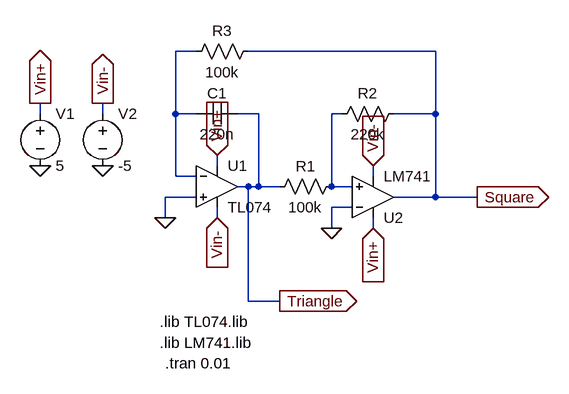
[diagram p0: schematic Draft19.asc]
Draft19.asc, the LTspice schematic file:
Version 4
SHEET 1 880 704
WIRE 304 208 272 208
WIRE 672 208 384 208
WIRE 64 304 64 288
WIRE 160 304 160 288
WIRE 272 304 272 208
WIRE 304 304 272 304
WIRE 400 304 368 304
WIRE 528 304 512 304
WIRE 672 304 672 208
WIRE 672 304 608 304
WIRE 336 384 336 368
WIRE 272 400 272 304
WIRE 304 400 272 400
WIRE 576 400 576 384
WIRE 384 416 368 416
WIRE 400 416 400 304
WIRE 400 416 384 416
WIRE 432 416 400 416
WIRE 512 416 512 304
WIRE 544 416 512 416
WIRE 304 432 256 432
WIRE 672 432 672 304
WIRE 672 432 608 432
WIRE 736 432 672 432
WIRE 544 448 512 448
WIRE 256 464 256 432
WIRE 336 464 336 448
WIRE 512 480 512 448
WIRE 576 480 576 464
WIRE 384 592 384 416
WIRE 432 592 384 592
FLAG 256 464 0
FLAG 512 480 0
FLAG 160 384 0
FLAG 64 384 0
FLAG 64 288 Vin+
IOPIN 64 288 Out
FLAG 160 288 Vin-
IOPIN 160 288 Out
FLAG 336 368 Vin+
IOPIN 336 368 In
FLAG 336 464 Vin-
IOPIN 336 464 In
FLAG 576 384 Vin-
IOPIN 576 384 In
FLAG 576 480 Vin+
IOPIN 576 480 In
FLAG 736 432 Square
IOPIN 736 432 Out
FLAG 432 592 Triangle
IOPIN 432 592 Out
SYMBOL Opamps/opamp2 336 352 R0
SYMATTR InstName U1
SYMATTR Value TL074
SYMBOL Opamps/opamp2 576 496 M180
SYMATTR InstName U2
SYMATTR Value LM741
SYMBOL res 528 400 R90
WINDOW 0 0 56 VBottom 2
WINDOW 3 32 56 VTop 2
SYMATTR InstName R1
SYMATTR Value 100k
SYMBOL res 400 192 R90
WINDOW 0 0 56 VBottom 2
WINDOW 3 32 56 VTop 2
SYMATTR InstName R3
SYMATTR Value 100k
SYMBOL cap 368 288 R90
WINDOW 0 0 32 VBottom 2
WINDOW 3 32 32 VTop 2
SYMATTR InstName C1
SYMATTR Value 220n
SYMBOL res 624 288 R90
WINDOW 0 0 56 VBottom 2
WINDOW 3 32 56 VTop 2
SYMATTR InstName R2
SYMATTR Value 220k
SYMBOL voltage 64 288 R0
SYMATTR InstName V1
SYMATTR Value 5
SYMBOL voltage 160 288 R0
SYMATTR InstName V2
SYMATTR Value -5
TEXT 248 624 Left 2 !.lib TL074.lib
TEXT 248 656 Left 2 !.lib LM741.lib
TEXT 256 688 Left 2 !.tran 0.01

The netlist it stands for:
* Draft19.asc
XU1 0 N001 Vin+ Vin- Triangle TL074  ; pins In+ In- V+ V- OUT
XU2 N002 0 Vin+ Vin- Square LM741  ; pins In+ In- V+ V- OUT
R1 N002 Triangle 100k
R3 Square N001 100k
C1 Triangle N001 220n
R2 Square N002 220k
V1 Vin+ 0 5
V2 Vin- 0 -5
.lib TL074.lib
.lib LM741.lib
.tran 0.01
.backanno
.end